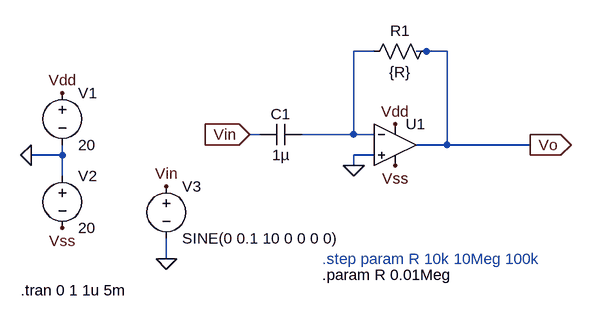
[diagram p0: schematic Ideal opamp inverting differentiator.asc]
Ideal opamp inverting differentiator.asc, the LTspice schematic file:
Version 4
SHEET 1 968 680
WIRE 640 48 608 48
WIRE 720 48 704 48
WIRE 752 48 720 48
WIRE 464 176 448 176
WIRE 608 176 608 48
WIRE 608 176 528 176
WIRE 640 176 608 176
WIRE 752 192 752 48
WIRE 752 192 704 192
WIRE 880 192 752 192
WIRE 160 208 160 192
WIRE 160 208 112 208
WIRE 640 208 608 208
WIRE 608 224 608 208
WIRE 160 240 160 208
WIRE 320 368 320 336
FLAG 112 208 0
FLAG 160 112 Vdd
FLAG 672 160 Vdd
FLAG 160 320 Vss
FLAG 672 224 Vss
FLAG 608 224 0
FLAG 320 368 0
FLAG 880 192 Vo
IOPIN 880 192 Out
FLAG 320 256 Vin
FLAG 448 176 Vin
IOPIN 448 176 In
SYMBOL voltage 160 96 R0
WINDOW 123 0 0 Left 0
WINDOW 39 0 0 Left 0
SYMATTR InstName V1
SYMATTR Value 20
SYMBOL voltage 160 224 R0
WINDOW 123 0 0 Left 0
WINDOW 39 0 0 Left 0
SYMATTR InstName V2
SYMATTR Value 20
SYMBOL Opamps\\UniversalOpamp2 672 192 R0
SYMATTR InstName U1
SYMBOL res 736 32 R90
WINDOW 0 0 56 VBottom 2
WINDOW 3 32 56 VTop 2
SYMATTR InstName R1
SYMATTR Value {R}
SYMBOL cap 528 160 R90
WINDOW 0 0 32 VBottom 2
WINDOW 3 32 32 VTop 2
SYMATTR InstName C1
SYMATTR Value 1µ
SYMBOL voltage 320 240 R0
WINDOW 123 0 0 Left 0
WINDOW 39 0 0 Left 0
SYMATTR InstName V3
SYMATTR Value SINE(0 0.1 10 0 0 0 0)
TEXT 560 368 Left 2 ;.step param R 10k 10Meg 100k
TEXT 560 392 Left 2 !.param R 0.01Meg
TEXT 96 416 Left 2 !.tran 0 1 1u 5m

The netlist it stands for:
* Ideal opamp inverting differentiator.asc
V1 Vdd 0 20
V2 0 Vss 20
XU1 0 N001 Vdd Vss Vo level.2 Avol=1Meg GBW=10Meg Slew=10Meg ilimit=25m rail=0 Vos=0 phimargin=45 en=0 enk=0 in=0 ink=0 Rin=500Meg  ; pins IN+ IN- V+ V- OUT
R1 Vo N001 {R}
C1 N001 Vin 1µ
V3 Vin 0 SINE(0 0.1 10 0 0 0 0)
* .step param R 10k 10Meg 100k
.param R 0.01Meg
.tran 0 1 1u 5m
.lib UniversalOpamps2.sub
.backanno
.end